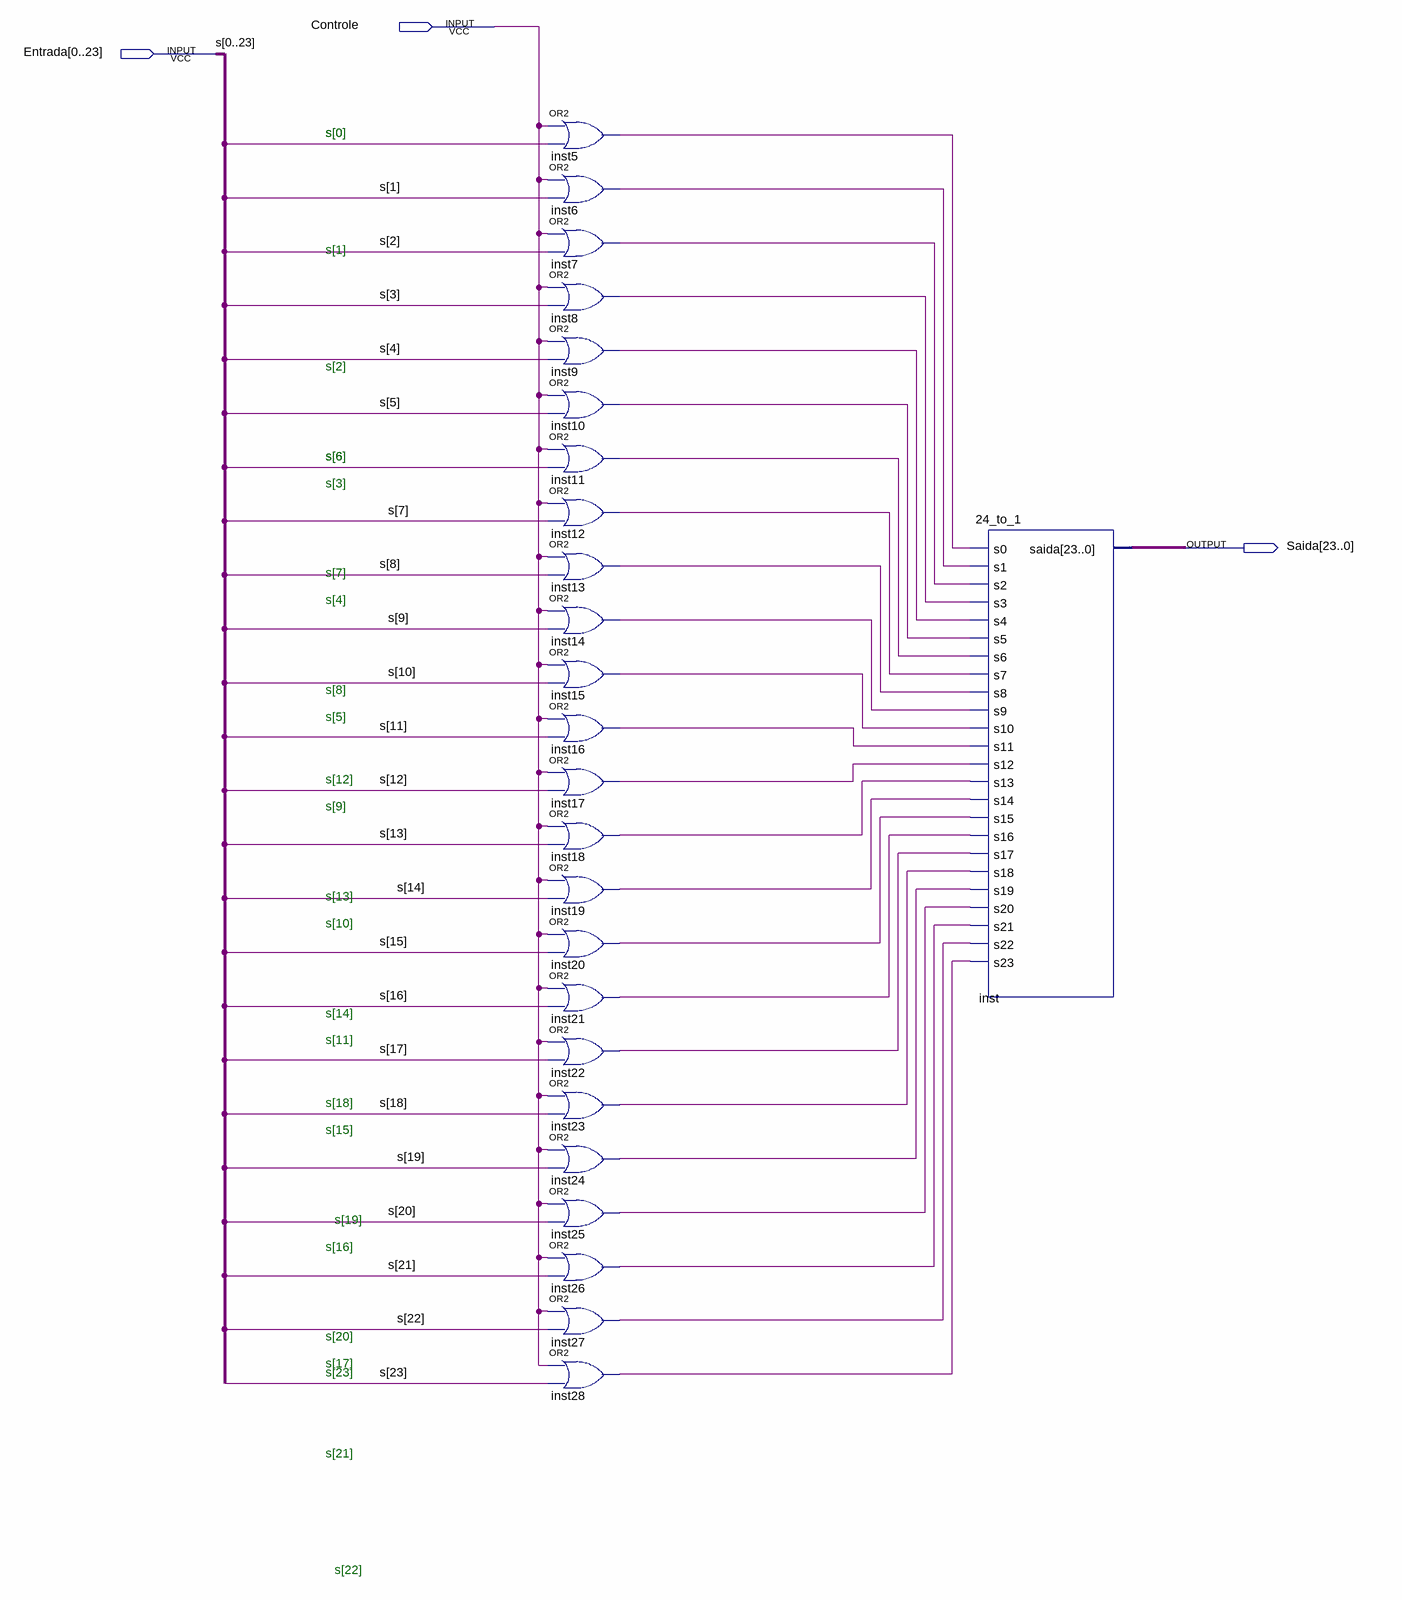
[diagram p0: schematic sheet]
// Quartus schematic 1_or_24.bdf as structural Verilog: 25 symbols, 3 pins
module \1_or_24  (
  input  Controle,
  input  [0:23] Entrada,
  output [23:0] Saida
);

  wire inst5_out, inst6_out, inst7_out, inst8_out, inst9_out, inst10_out, inst11_out, inst12_out, inst13_out,
       inst14_out, inst15_out, inst16_out, inst17_out, inst18_out, inst19_out, inst20_out, inst21_out,
       inst22_out, inst23_out, inst24_out, inst25_out, inst26_out, inst27_out, inst28_out;

  or inst5 (inst5_out, Controle, Entrada[0]);
  or inst6 (inst6_out, Controle, Entrada[1]);
  or inst7 (inst7_out, Controle, Entrada[2]);
  or inst8 (inst8_out, Controle, Entrada[3]);
  or inst9 (inst9_out, Controle, Entrada[4]);
  or inst10 (inst10_out, Controle, Entrada[5]);
  or inst11 (inst11_out, Controle, Entrada[6]);
  or inst12 (inst12_out, Controle, Entrada[7]);
  or inst13 (inst13_out, Controle, Entrada[8]);
  or inst14 (inst14_out, Controle, Entrada[9]);
  or inst15 (inst15_out, Controle, Entrada[10]);
  or inst16 (inst16_out, Controle, Entrada[11]);
  or inst17 (inst17_out, Controle, Entrada[12]);
  or inst18 (inst18_out, Controle, Entrada[13]);
  or inst19 (inst19_out, Controle, Entrada[14]);
  or inst20 (inst20_out, Controle, Entrada[15]);
  or inst21 (inst21_out, Controle, Entrada[16]);
  or inst22 (inst22_out, Controle, Entrada[17]);
  or inst23 (inst23_out, Controle, Entrada[18]);
  or inst24 (inst24_out, Controle, Entrada[19]);
  or inst25 (inst25_out, Controle, Entrada[20]);
  or inst26 (inst26_out, Controle, Entrada[21]);
  or inst27 (inst27_out, Controle, Entrada[22]);
  or inst28 (inst28_out, Controle, Entrada[23]);
  \24_to_1  inst (
    .s0(inst5_out), .s1(inst6_out), .s2(inst7_out), .s3(inst8_out), .s4(inst9_out), .s5(inst10_out),
    .s6(inst11_out), .s7(inst12_out), .s8(inst13_out), .s9(inst14_out), .s10(inst15_out), .s11(inst16_out),
    .s12(inst17_out), .s13(inst18_out), .s14(inst19_out), .s15(inst20_out), .s16(inst21_out),
    .s17(inst22_out), .s18(inst23_out), .s19(inst24_out), .s20(inst25_out), .s21(inst26_out),
    .s22(inst27_out), .s23(inst28_out), .saida(Saida));

  // Other names for the same wires on the sheet: s[23:0] = {Entrada[23], Entrada[22], Entrada[21], Entrada[20], Entrada[19], Entrada[18], Entrada[17], Entrada[16], Entrada[15], Entrada[14], Entrada[13], Entrada[12], Entrada[11], Entrada[10], Entrada[9], Entrada[8], Entrada[7], Entrada[6], Entrada[5], Entrada[4], Entrada[3], Entrada[2], Entrada[1], Entrada[0]}

  // Notes on the sheet:
  //   s[0]
  //   s[1]
  //   s[2]
  //   s[6]
  //   s[3]
  //   s[7]
  //   s[4]
  //   s[8]
  //   s[5]
  //   s[12]
  //   s[9]
  //   s[13]
  //   s[10]
  //   s[14]
  //   s[11]
  //   s[18]
  //   s[15]
  //   s[19]
  //   s[16]
  //   s[20]
  //   s[17]
  //   s[23]
  //   s[21]
  //   s[22]
endmodule
